# EAGLE design PW-Stick (EAGLE 6.6.0)
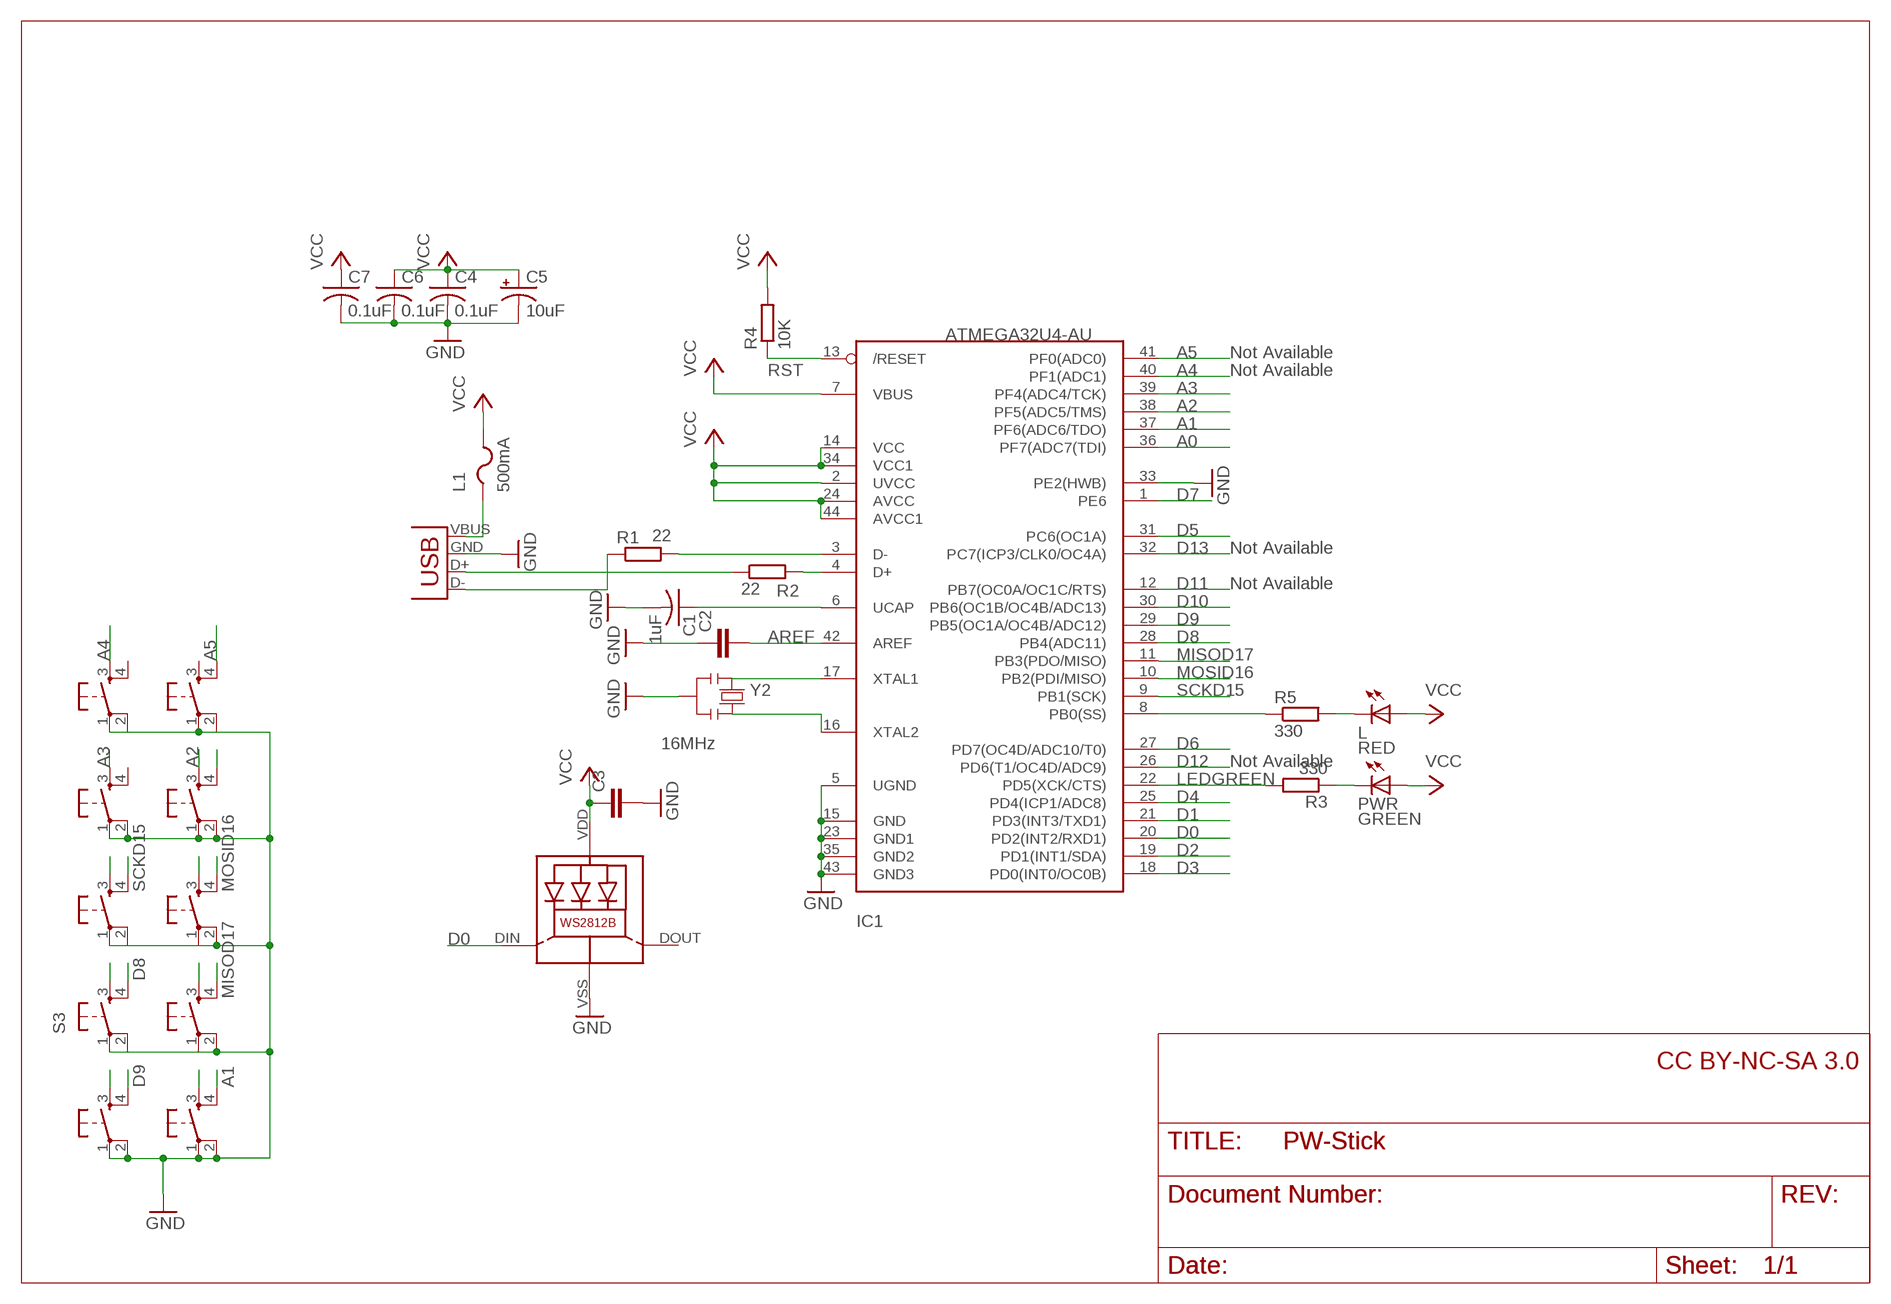
[diagram p0: schematic, sheet 1]

## Parts
C1  1uF  C-USC0805K  [C0805K]
C2  C-EUC0805  [C0805]
C3  C-EUC0805  [C0805]
C4  0.1uF  C-USC0805K  [C0805K]
C5  10uF  CPOL-USA/3216-18R  [A/3216-18R]
C6  0.1uF  C-USC0805K  [C0805K]
C7  0.1uF  C-USC0805K  [C0805K]
IC1  ATMEGA32U4-AU  [TQFP44]
JP2  USB-A-H  [USB-A-H]
L  RED  LEDCHIPLED_0805  [CHIPLED_0805]
L1  500mA  PTCFUSE-1206  [R1206]
LED1  WS2812B  [WS2812B]
PWR  GREEN  LEDCHIPLED_0805  [CHIPLED_0805]
R1  22  R-EU_R0805  [R0805]
R2  22  R-EU_R0805  [R0805]
R3  330  R-EU_R0805  [R0805]
R4  10K  R-EU_R0805  [R0805]
R5  330  R-EU_R0805  [R0805]
S1  DTSM-6  [DTSM-6]
S2  DTSM-6  [DTSM-6]
S3  DTSM-6  [DTSM-6]
S4  DTSM-6  [DTSM-6]
S5  DTSM-6  [DTSM-6]
S6  DTSM-6  [DTSM-6]
S7  DTSM-6  [DTSM-6]
S8  DTSM-6  [DTSM-6]
S9  DTSM-6  [DTSM-6]
S10  DTSM-6  [DTSM-6]
Y2  16MHz  RESONATORMU  [RESONATOR]

## Nets
A0: IC1.36(PF7(ADC7(TDI))
A1: IC1.37(PF6(ADC6/TDO)) S2.4
A2: IC1.38(PF5(ADC5/TMS)) S8.3
A3: IC1.39(PF4(ADC4/TCK)) S7.3
A4: IC1.40(PF1(ADC1)) S9.3
A5: IC1.41(PF0(ADC0)) S10.4
AREF: C2.2 IC1.42(AREF)
D0: IC1.20(PD2(INT2/RXD1)) LED1.DIN(DI)
D1: IC1.21(PD3(INT3/TXD1))
D2: IC1.19(PD1(INT1/SDA))
D3: IC1.18(PD0(INT0/OC0B))
D4: IC1.25(PD4(ICP1/ADC8))
D5: IC1.31(PC6(OC1A))
D6: IC1.27(PD7(OC4D/ADC10/T0))
D7: IC1.1(PE6)
D8: IC1.28(PB4(ADC11)) S3.4
D9: IC1.29(PB5(OC1A/OC4B/ADC12)) S1.4
D10: IC1.30(PB6(OC1B/OC4B/ADC13))
D11: IC1.12(PB7(OC0A/OC1C/RTS))
D12: IC1.26(PD6(T1/OC4D/ADC9))
D13: IC1.32(PC7(ICP3/CLK0/OC4A))
GND: C1.2 C2.1 C3.2 C4.2 C5.- C6.2 C7.2 IC1.5(UGND) IC1.15(GND) IC1.23(GND1) IC1.33(PE2(HWB)) IC1.35(GND2) IC1.43(GND3) JP2.GND(VBUS) LED1.VSS(GND) S1.1 S1.2 S2.1 S2.2 S3.1 S4.2 S5.1 S6.2 S7.1 S7.2 S8.1 S8.2 S9.1 S10.1 Y2.2
LEDGREEN: IC1.22(PD5(XCK/CTS)) R3.2
MISOD17: IC1.11(PB3(PDO/MISO)) S4.4
MOSID16: IC1.10(PB2(PDI/MISO)) S6.3
N$1: PWR.C R3.1
N$2: JP2.D+(D-) R2.1
N$3: IC1.3(D-) R1.2
N$4: IC1.4(D+) R2.2
N$5: JP2.D-(D+) R1.1
N$6: IC1.8(PB0(SS)) R5.1
N$7: L.C R5.2
N$8: IC1.17(XTAL1) Y2.1
N$9: IC1.16(XTAL2) Y2.3
N$10: C1.1 IC1.6(UCAP)
N$11: S8.4
N$12: S5.4
N$14: S6.4
N$16: S3.3
N$19: S4.3
N$20: S2.3
N$22: S1.3
RST: IC1.13(/RESET) R4.1
SCKD15: IC1.9(PB1(SCK)) S5.3
VBUS: JP2.VBUS(GND) L1.1
VCC: C3.1 C4.1 C5.+ C6.1 C7.1 IC1.2(UVCC) IC1.7(VBUS) IC1.14(VCC) IC1.24(AVCC) IC1.34(VCC1) IC1.44(AVCC1) L1.2 L.A LED1.VDD PWR.A R4.2
Unconnected: LED1.DOUT(DO) S3.2 S4.1 S5.2 S6.1 S7.4 S9.2 S9.4 S10.2 S10.3

## Notes on the sheet
- Not Available
- Not Available
- Not Available
- Not Available
- Not Available
- CC BY-NC-SA 3.0

## Library data of the parts
C1 C4 C6 C7 = adafruit:C-US: CAPACITOR, American symbol
C2 C3 = rcl:C-EU: CAPACITOR, European symbol
C5 = adafruit:CPOL-US: POLARIZED CAPACITOR, American symbol
IC1 = adaprog:ATMEGA32U4
JP2 = SparkFun-Connectors:USB: USB Connectors USB-B-PTH is fully proven SKU : PRT-00139/CONN-08278 USB-miniB is fully proven SKU : PRT-00587 USB-A-PCB is untested. USB-A-H is throughly reviewed, but untested. Spark Fun Electronics SKU : PRT-00437 USB-B-SMT is throughly reviewed, but untested. Needs silkscreen touching up. USB-A-S has not been used/tested USB-MB-H has not been used/tested USB-MICROB has been used. CONN-09505
L PWR = adafruit:LED: LED OSRAM: - CHIPLED LG R971, LG N971, LY N971, LG Q971, LY Q971, LO R971, LY R971 LH N974, LH R974 LS Q976, LO Q976, LY Q976 LO Q996 - Hyper CHIPLED LW Q18S LB Q993, LB Q99A, LB R99A - SideLED LS A670, LO A670, LY A670, LG A670, LP A670 LB A673, LV A673, LT A673, LW A673 LH A674 LY A675 LS A676, LA A676, LO A676, LY A676, LW A676 LS A679, LY A679, LG A679 - Hyper Micro SIDELED® LS Y876, LA Y876, LO Y876, LY Y876 LT Y87S - SmartLED LW L88C, LW L88S LB L89C, LB L89S, LG L890 LS L89K, LO L89K, LY L89K LS L896, LA L896, LO L896, LY L896 - TOPLED LS T670, LO T670, LY T670, LG T670, LP T670 LSG T670, LSP T670, LSY T670, LOP T670, LYG T670 LG T671, LOG T671, LSG T671 LB T673, LV T673, LT T673, LW T673 LH T674 LS T676, LA T676, LO T676, LY T676, LB T676, LH T676, LSB T676, LW T676 LB T67C, LV T67C, LT T67C, LS T67K, LO T67K, LY T67K, LW E67C LS E67B, LA E67B, LO E67B, LY E67B, LB E67C, LV E67C, LT E67C LW T67C LS T679, LY T679, LG T679 LS T770, LO T770, LY T770, LG T770, LP T770 LB T773, LV T773, LT T773, LW T773 LH T774 LS E675, LA E675, LY E675, LS T675 LS T776, LA T776, LO T776, LY T776, LB T776 LHGB T686 LT T68C, LB T68C - Hyper Mini TOPLED® LB M676 - Mini TOPLED Santana® LG M470 LS M47K, LO M47K, LY M47K Source: http://www.osram.convergy.de/
L1 = adafruit:PTCFUSE: PTC fuses, resettable thermistors
LED1 = WS2812B:WS2812B: Features and Benefits  * Intelligent reverse connect protection, the power supply reverse connection does not damage the IC. * The control circuit and the LED share the only power source. Control circuit and RGB chip are integrated in a package of 5050 components, form a complete control of pixel point.  * Built-in signal reshaping circuit, after wave reshaping to the next driver, ensure wave-form distortion not accumulate.  * Built-in electric reset circuit and power lost reset circuit.  * Each pixel of the three primary color can achieve 256 brightness display, completed 16777216 color full color display, and scan frequency not less than 400Hz/s.  * Cascading port transmission signal by single line.  * Any two point the distance more than 5m transmission signal without any increase circuit.  * When the refresh rate is 30fps, cascade number are not less than1024 points.  * Send data at speeds of 800Kbps.  *The color of the light were highly consistent, cost-effective. Applications  Full-color module, Full color soft lights a lamp strip. LED decorative lighting, Indoor/outdoor LED video irregular screen. General description WS2812B is a intelligent control LED light source that the control circuit and RGB chip are integrated in a package of 5050 components. It internal include intelligent digital port data latch and signal reshaping amplification drive circuit. Also include a precision internal oscillator and a 12V voltage programmable constant curre-nt control part, effectively ensuring the pixel point light color height consistent. The data transfer protocol use single NZR communication mode. After the pixel power-on reset, the DIN port receive data from controller, the first pixel collect initial 24bit data then sent to the internal data latch, the other data which reshaping by the internal signal reshaping amplification circuit sent to the next cascade pixel through the DO port. After transmission for each pixel,the signal to reduce 24bit. pixel adopt auto reshaping transmit technology, making the pixel cascade number is not limited the signal transmission, only depend on the speed of signal transmission. LED with low driving voltage, environmental protection and energy saving, high brightness, scattering angle is large, good consistency, low power, long life and other advantages. The control chip integrated in LED above becoming more simple circuit, small volume, convenient installation. Absolute Maximum Ratings Power supply voltage: VDD +3.5V..+5.3V Input voltage: VI -0.5V..VDD+0.5V based on WS2812 from https://github.com/adafruit/Adafruit-Eagle-Library
R1-R5 = rcl:R-EU_: RESISTOR, European symbol
S1-S10 = switch-tact:DTSM-6
Y2 = SmartPrj:RESONATOR

## Board
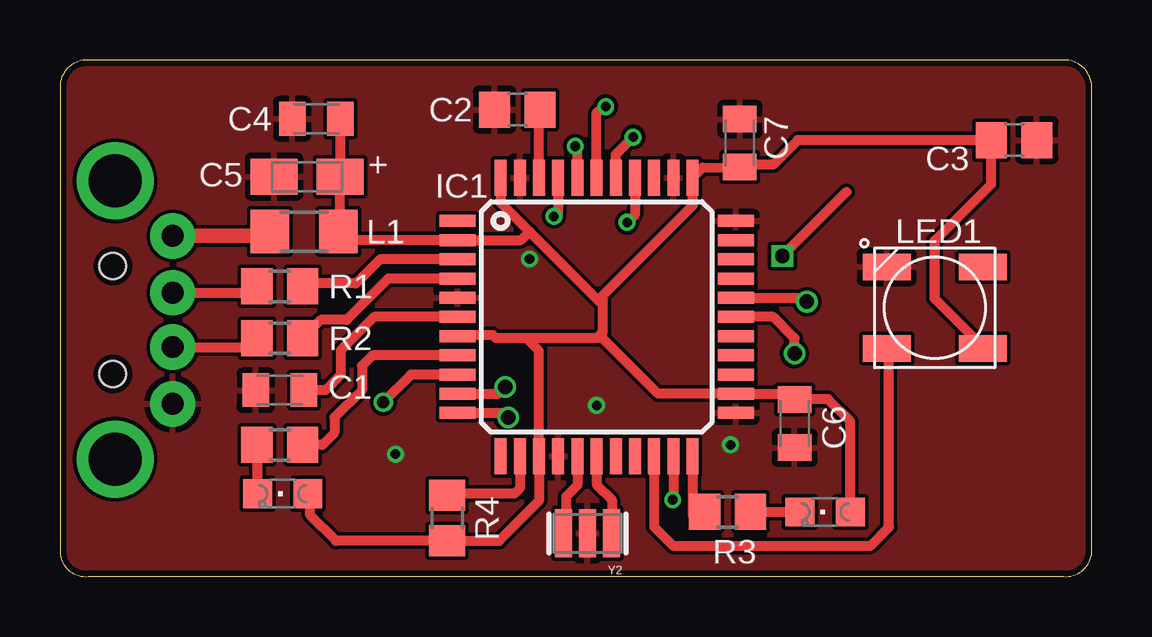
[diagram p1: board, top side]
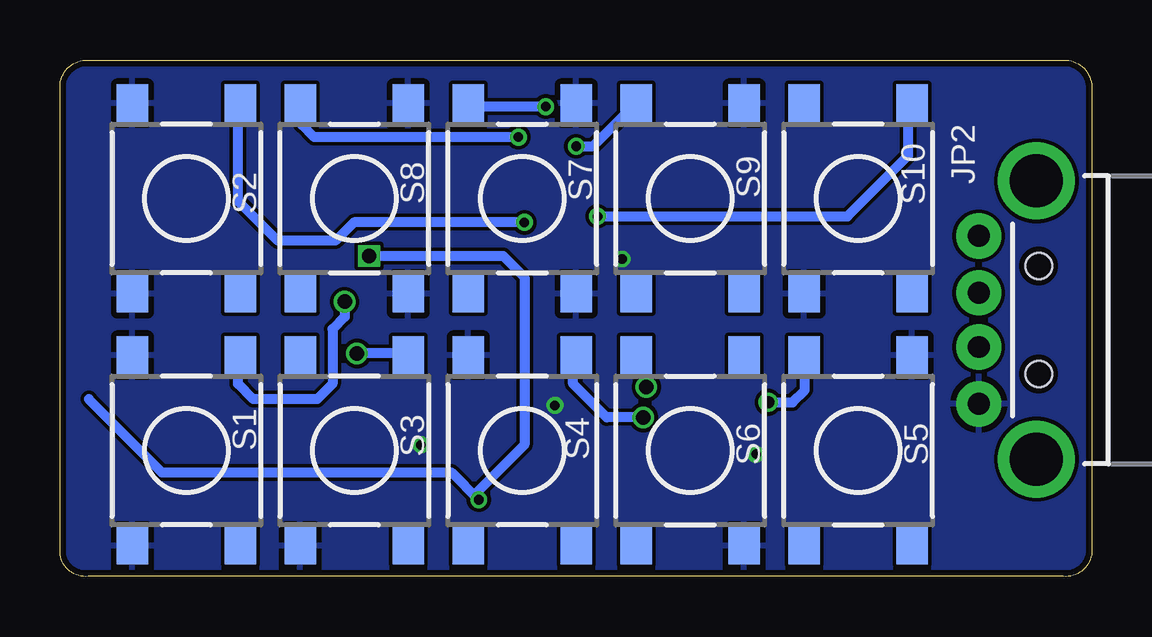
[diagram p2: board, bottom side, seen from below]

Size 43 x 21.52 mm. Coordinates in mm from the lower left corner, seen from the top.
Outline: 1.27,21.52 arc90 0,20.52 0,0.91 arc90 1.27,0.02 41.73,0.02 arc90 43,0.91 43,20.52 arc90 41.73,21.52 1.27,21.52
Copper layers (1*16): Top 0.035mm / dielectric 1.5mm / Bottom 0.035mm
Design rules "ITEADstudio_DRC": minimum track width 6mil, minimum drill 12mil, track to track 6mil, track to pad 6mil, pad to pad 6mil, via to via 6mil, smd to smd 0mil, copper to edge 10mil, drill to drill 10mil, minimum pad ring 10mil, minimum via ring 6mil, stop-mask expansion 2mil, vias tented up to drill 100mil, thermal gap 10mil

### Footprints (pad centres in the part's own frame; a part is rotated, then mirrored left to right if it is on the bottom)
C0805K = smd 1.1 x 1.4: 1 -1,0; 2 1,0
C0805 = smd 1.3 x 1.5: 1 -0.95,0; 2 0.95,0
A/3216-18R = smd 1.95 x 1.5: + 1.375,0; - -1.375,0
TQFP44 = smd 1.5 x 0.5: 1 -5.8,4; 2 -5.8,3.2; 3 -5.8,2.4; 4 -5.8,1.6; 5 -5.8,0.8; 6 -5.8,0; 7 -5.8,-0.8; 8 -5.8,-1.6; 9 -5.8,-2.4; 10 -5.8,-3.2; 11 -5.8,-4; 23 5.8,-4; 24 5.8,-3.2; 25 5.8,-2.4; 26 5.8,-1.6; 27 5.8,-0.8; 28 5.8,0; 29 5.8,0.8; 30 5.8,1.6; 31 5.8,2.4; 32 5.8,3.2; 33 5.8,4 | smd 0.5 x 1.5: 12 -4,-5.8; 13 -3.2,-5.8; 14 -2.4,-5.8; 15 -1.6,-5.8; 16 -0.8,-5.8; 17 0,-5.8; 18 0.8,-5.8; 19 1.6,-5.8; 20 2.4,-5.8; 21 3.2,-5.8; 22 4,-5.8; 34 4,5.8; 35 3.2,5.8; 36 2.4,5.8; 37 1.6,5.8; 38 0.8,5.8; 39 0,5.8; 40 -0.8,5.8; 41 -1.6,5.8; 42 -2.4,5.8; 43 -3.2,5.8; 44 -4,5.8
USB-A-H = drill 0.914 pad 1.88: D+ 2.4,1.127; D- 2.4,-1.127; GND 2.4,3.5; VBUS 2.4,-3.5 | drill 2.2: GND2 0,-5.8; GND3 0,5.8 | hole 1.1: -0.1,2.25; -0.1,-2.25
CHIPLED_0805 = smd 1.2 x 1.2: A 0,-1.05; C 0,1.05
R1206 = smd 1.6 x 1.803: 1 -1.422,0; 2 1.422,0
WS2812B = smd 2 x 1.1: DIN 2,1.7; DOUT -2,-1.7; VDD -2,1.7; VSS 2,-1.7
R0805 = smd 1.3 x 1.5: 1 -0.95,0; 2 0.95,0
DTSM-6 = smd 1.55 x 1.3: 1 -3.975,2.25; 2 3.975,2.25; 3 -3.975,-2.25; 4 3.975,-2.25
RESONATOR = smd 0.7 x 2: 1 -1,0; 2 0,0; 3 1,0

### Placement (x,y rotation side)
C1  9.16,7.77 180 top
C2  19.07,19.45 0 top
C3  39.77,18.18 0 top
C4  10.68,19.07 180 top
C5  10.3,16.66 0 top
C6  30.62,6.37 270 top
C7  28.34,18.06 90 top
IC1  22.37,10.82 0 top
JP2  2.3,10.69 180 bottom
L  9.29,3.45 90 top
L1  10.18,14.37 0 top
LED1  36.47,11.2 180 top
PWR  31.89,2.69 90 top
R1  9.16,12.09 0 top
R2  9.16,9.93 0 top
R3  27.83,2.69 180 top
R4  16.14,2.44 270 top
R5  9.16,5.48 180 top
S1  37.73,5.25 90 bottom
S2  37.73,15.75 90 bottom
S3  30.73,5.25 90 bottom
S4  23.73,5.25 90 bottom
S5  9.73,5.25 270 bottom
S6  16.73,5.25 270 bottom
S7  23.73,15.75 270 bottom
S8  30.73,15.75 270 bottom
S9  16.73,15.75 270 bottom
S10  9.73,15.75 90 bottom
Y2  21.99,1.8 180 top

### Tracks (layer width: path | path; a pad name or v marks a point on that pad's centre or on a via)
A1  (via drill 0.4)
  Top 0.406: IC1.37 23.97,15.09 v23.64,14.76
  Bottom 0.406: v23.64,14.76 30.75,14.76 31.51,13.99 33.92,13.99 35.58,15.64 35.58,19.63 S2.4
A2  (via drill 0.4)
  Top 0.406: IC1.38 23.17,17.59 v23.89,18.31
  Bottom 0.406: v23.89,18.31 32.4,18.31 32.91,18.82 32.91,19.66 S8.3
A3  (via drill 0.4)
  Top 0.406: IC1.39 22.37,19.33 v22.75,19.58
  Bottom 0.406: v22.75,19.58 25.83,19.58 S7.3
A4  (via drill 0.4)
  Top 0.406: IC1.40 21.57,17.84 v21.48,17.93
  Bottom 0.406: v21.48,17.93 20.78,17.93 S9.3
A5  (via drill 0.4)
  Top 0.406: IC1.41 20.77,15.19 v20.59,15.01
  Bottom 0.406: v20.59,15.01 10.18,15.01 7.64,17.55 7.64,19.57 S10.4
AREF
  Top 0.406: IC1.42 19.97,19.41 C2.2
D0
  Top 0.406: IC1.20 24.77,2.07 25.54,1.29 33.8,1.29 34.56,2.06 34.56,9.4 LED1.DIN
D1  (via drill 0.4, 0.6)
  Top 0.406: 32.78,16.03 v30.11,13.36 | IC1.21 25.57,3.22 v25.54,3.2
  Bottom 0.406: v30.11,13.36 24.53,13.36 23.64,12.47 23.64,5.48 25.54,3.58 v25.54,3.2 26.69,4.34 38.75,4.34 41.8,7.39
D8  (via drill 0.6)
  Top 0.406: v30.62,9.29 30.62,9.93 29.73,10.82 IC1.28
  Bottom 0.406: S3.4 28.48,9.29 v30.62,9.29
D9  (via drill 0.6)
  Top 0.406: IC1.29 30.97,11.62 v31.13,11.45
  Bottom 0.406: v31.13,11.45 31.13,10.82 31.64,10.31 31.64,8.02 32.27,7.39 34.94,7.39 35.58,8.02 35.58,9.13 S1.4
GND  (via drill 0.4)
  other vias: 19.57,13.23 27.96,5.48 13.99,5.1 22.37,7.14
  pour Top: -1,-0.48 -1,21.92 43,21.92 43,-0.48
  pour Bottom: -1,21.92 -1,-0.48 43,-0.48 43,21.92
LEDGREEN
  Top 0.406: IC1.22 26.37,2.57 R3.2
MISOD17  (via drill 0.6)
  Top 0.406: IC1.11 18.49,6.82 v18.68,6.63
  Bottom 0.406: v18.68,6.63 20.21,6.63 21.61,8.02 21.61,9.1 S4.4
MOSID16  (via drill 0.6)
  Top 0.406: IC1.10 18.28,7.62 v18.56,7.9
  Bottom 0.406: v18.56,7.9 18.56,8.81 S6.3
N$1
  Top 0.406: R3.1 PWR.C
N$2
  Top 0.406: JP2.D+ 7.85,9.56 R2.1
N$3
  Top 0.406: IC1.3 13.34,13.22 12.34,12.22 10.24,12.22 R1.2
N$4
  Top 0.406: IC1.4 13.68,12.42 11.95,10.69 10.87,10.69 R2.2
N$5
  Top 0.406: JP2.D- 7.94,11.82 R1.1
N$6
  Top 0.406: IC1.8 13.02,9.22 12.59,8.79 12.59,7.77 11.45,6.63 11.45,5.99 10.94,5.48 R5.1
N$7
  Top 0.406: R5.2 8.21,3.48 L.C
N$8
  Top 0.406: IC1.17 22.37,3.83 23,3.2 23,1.82 Y2.1
N$9
  Top 0.406: IC1.16 21.57,3.8 21.1,3.33 21.1,1.91 Y2.3
N$10
  Top 0.406: IC1.6 13.1,10.82 11.7,9.42 11.7,8.41 11.06,7.77 C1.1
RST
  Top 0.406: IC1.13 19.17,3.68 18.94,3.45 16.21,3.45 R4.1
SCKD15  (via drill 0.5)
  Top 0.406: IC1.9 14.63,8.42 v13.48,7.26
  Bottom 0.406: v13.48,7.26 12.46,7.26 11.95,7.77 11.95,9.2 S5.3
VBUS
  Top 0.61: JP2.VBUS 8.57,14.19 L1.1
VCC
  Top 0.406: 22.37,9.93 22.62,9.93 24.93,7.62 IC1.24 30.27,7.62 30.62,7.26 C6.1 30.64,7.39 32.02,7.39 32.94,6.47 PWR.A | 22.37,9.93 19.45,9.93 | 19.45,9.93 18.18,9.93 18.05,10.06 16.61,10.06 IC1.7 | 19.45,9.93 19.97,9.41 IC1.14 19.97,3.15 18.3,1.49 R4.2 11.51,1.49 10.43,2.56 10.43,3.36 L.A | 22.62,11.33 22.62,11.71 26.37,15.45 IC1.34 26.79,17.04 C7.1 28.45,17.17 29.73,17.17 30.75,18.18 C3.1 | 22.62,11.33 22.62,10.18 22.37,9.93 | IC1.44 18.37,15.58 19.57,14.37 | 19.57,14.37 22.62,11.33 | 19.57,14.37 19.22,14.02 IC1.2 11.6,14.02 L1.2 11.68,14.37 C5.+ C4.1 | 38.5,17.86 C3.1 | LED1.VDD 38.47,9.58 36.47,11.58 36.47,13.99 38.82,16.35 C3.1